# EAGLE design M8-SHT30 (EAGLE 9.6.2)
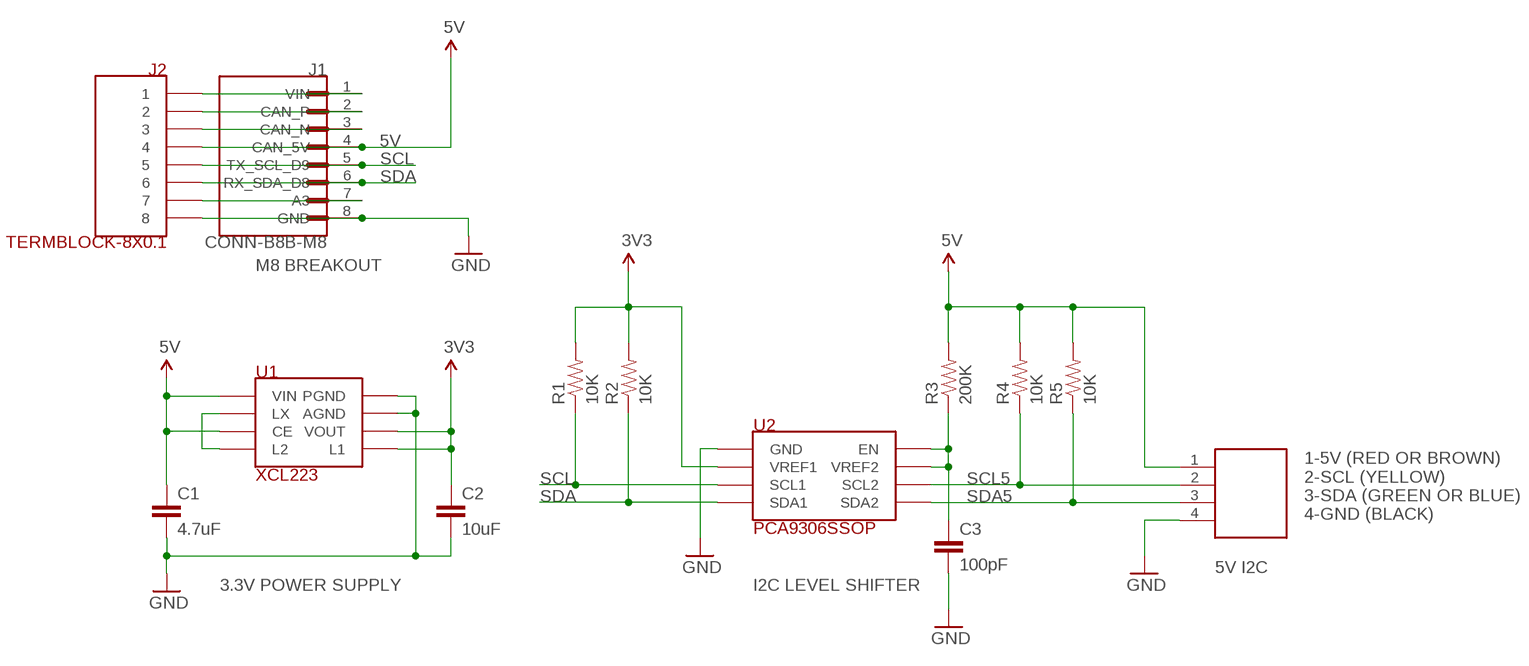
[diagram p0: schematic, sheet 1]

## Parts
C1  4.7uF  CAP-4.7UF-0603  [0603-CAP]
C2  10uF  CAP-10UF-0603  [0603-CAP]
C3  100pF  CAP-100PF-0603  [0603-CAP]
J1  CONN-B8B-M8  [JST_B8B-PH-SM4-TB(LF)(SN)]
J2  TERMBLOCK-8X0.1  [TERMBLOCK-8X0.1]
R1  10K  RES-10K-06030603  [0603-RES]
R2  10K  RES-10K-06030603  [0603-RES]
R3  200K  RES-200K-0603  [0603-RES]
R4  10K  RES-10K-06030603  [0603-RES]
R5  10K  RES-10K-06030603  [0603-RES]
U1  XCL223  REG-XCL223  [REG-XCL223-LESS-CREAM]
U2  PCA9306SSOP  [8-SSOP-TI]
U$1  TERMBLOCK-4X0.15  [TERMBLOCK-4X0.15]

## Nets
3V3: C2.1 R1.2 R2.2 U1.3(VOUT) U1.7(L1) U2.2(VREF1)
5V: C1.1 J1.4(CAN_5V) J2.P$4 R3.2 R4.2 R5.2 U1.4(CE) U1.6(VIN) U$1.1
A3: J1.7(A3) J2.P$7
CAN_N: J1.3(CAN_N) J2.P$3
CAN_P: J1.2(CAN_P) J2.P$2
GND: C1.2 C2.2 C3.2 J1.8(GND) J2.P$8 U1.1(PGND) U1.2(AGND) U2.1(GND) U$1.4
LX: U1.5(LX) U1.8(L2)
SCL: J1.5(TX_SCL_D9) J2.P$5 R1.1 U2.3(SCL1)
SCL5: R4.1 U2.6(SCL2) U$1.2
SDA: J1.6(RX_SDA_D8) J2.P$6 R2.1 U2.4(SDA1)
SDA5: R5.1 U2.5(SDA2) U$1.3
VIN: J1.1(VIN) J2.P$1
VREF2_EN: C3.1 R3.1 U2.7(VREF2) U2.8(EN)

## Notes on the sheet
- M8 BREAKOUT
- 1-5V (RED OR BROWN)
  2-SCL (YELLOW)
  3-SDA (GREEN OR BLUE)
  4-GND (BLACK)
- 5V I2C
- 3.3V POWER SUPPLY | I2C LEVEL SHIFTER

## Library data of the parts
C1 = rickk2:CAP-4.7UF-0603: Murata X5R series CAP CER 4.7UF 6.3V X5R 0603 $0.12 https://www.digikey.com/product-detail/en/murata-electronics-north-america/GRM188R60J475KE19J/490-6407-1-ND/3845604
C2 = rickk2:CAP-10UF-0603: CAP CER 10UF 16V X5R 0805 $ 0.21 https://www.digikey.com/product-detail/en/murata-electronics-north-america/GRM21BR61C106KE15L/490-3886-1-ND/965928
C3 = rickk2:CAP-100PF-0603: CAP 100PF 0603
J1 = rickk2:CONN-B8B-M8: PH Series 2 mm Pitch 12 Position SMT Single Row Top Entry Shrouded Header
J2 = rickk2:TERMBLOCK-8X0.1: Term Block 8x0.1" 20-30AWG 6A 125V Max Side Entry On Shore Technology Inc. OSTVN08A150 TERM BLK 8P SIDE ENT 2.54MM PCB 8 Position Wire to Board Terminal Block Horizontal with Board 0.100" (2.54mm) Through Hole https://www.digikey.com/product-detail/en/on-shore-technology-inc/OSTVN08A150/ED10566-ND/1588868
R1 R2 R4 R5 = rickk2:RES-10K-0603: RES SMD 10K OHM 5% 1/4W 0603 $ 0.10 https://www.digikey.com/product-detail/en/panasonic-electronic-components/ERJ-PA3J103V/P10KBZCT-ND/5036237
R3 = rickk2:RES-200K-0603: RES SMD 200K https://www.digikey.com/product-detail/en/panasonic-electronic-components/ERJ-3EKF2003V/P200KHCT-ND/198241
U1 = rickk2:REG-XCL223: Manufacturer: Torex Semiconductor Ltd Manufacturer Part Number: XCL223A333D2-G DC DC CONVERTER 3.3V Detailed Description: Non-Isolated PoL Modul $2.63 https://www.digikey.com/product-detail/en/torex-semiconductor-ltd/XCL223A333D2-G/893-1416-1-ND/8256118 CIN=4.7uF 10V CL = 10uF 10V VIN MAX=5.5V VOUT=3.3V
U2 = rickk2:PCA9306: IC TRNSLTR BIDIRECTIONAL SM8 PCA9306DCTR $0.67 https://www.digikey.com/product-detail/en/texas-instruments/PCA9306DCTR/296-18509-1-ND/809938 VREF1=3.3V VREF2=5V connect w/200K res and 100 pF cap to GND Use 8-SSOP version!
U$1 = rickk2:TERMBLOCK-4X0.15: Have this - used on GarageDoor2 for prox sensor

## Board
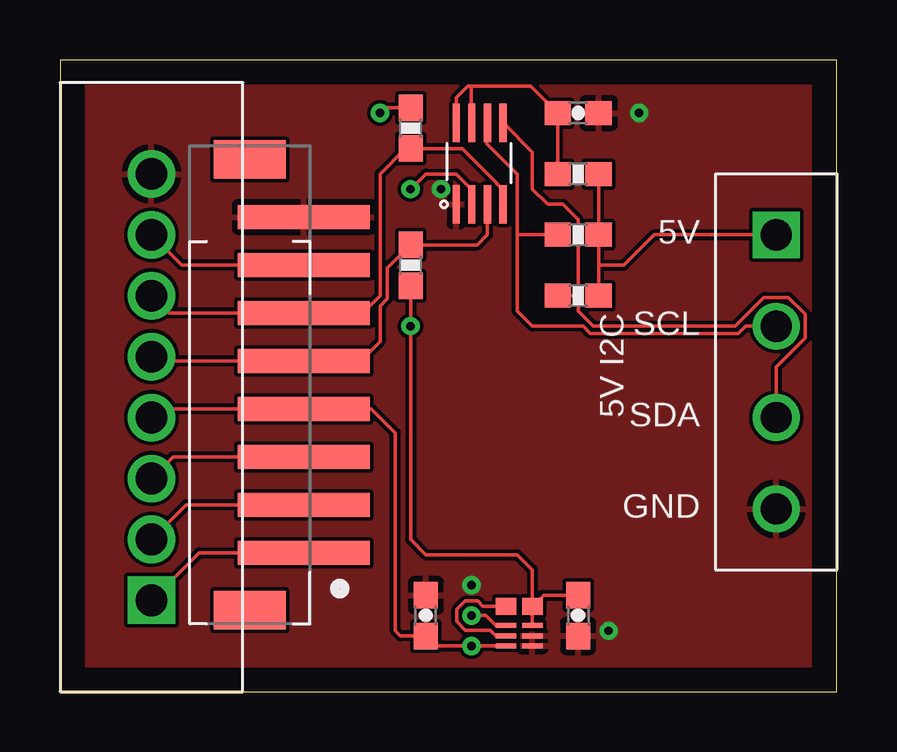
[diagram p1: board, top side]
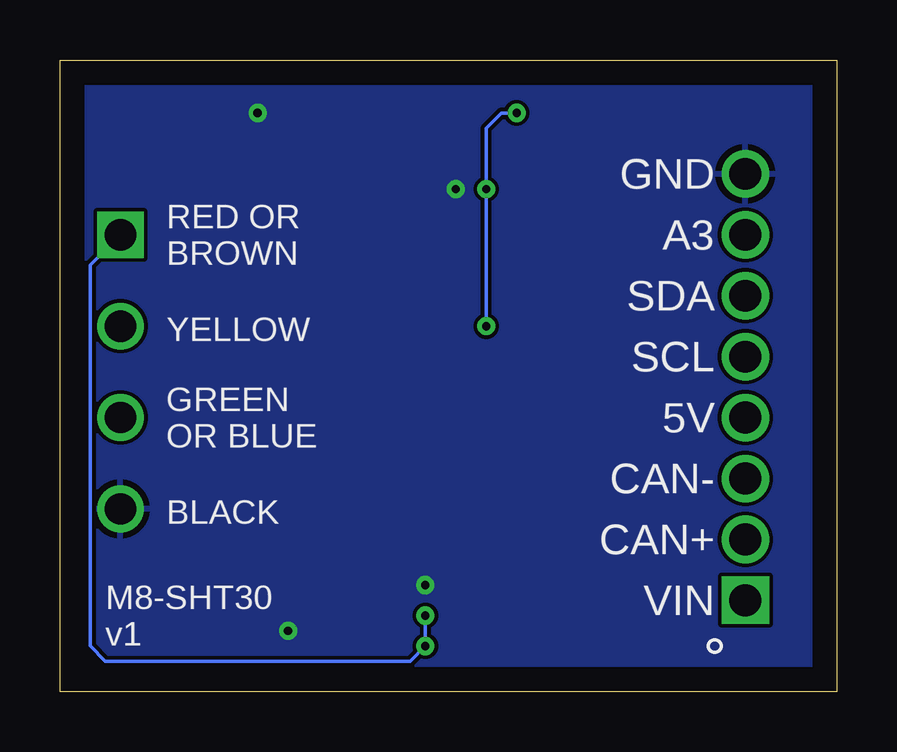
[diagram p2: board, bottom side, seen from below]

Size 32.37 x 26.34 mm. Coordinates in mm from the lower left corner, seen from the top.
Outline: 0,0 32.37,0 32.37,26.34 0,26.34 0,0
Copper layers (1*16): Top 0.035mm / dielectric 1.5mm / Bottom 0.035mm
Design rules "default": minimum track width 6mil, minimum drill 0.35mm, track to track 6mil, track to pad 6mil, pad to pad 6mil, via to via 6mil, smd to smd 6mil, copper to edge 40mil, drill to drill 6mil, minimum pad ring 10mil, minimum via ring 8mil, stop-mask expansion 4mil, vias tented up to drill 0mil, thermal gap 10mil

### Footprints (pad centres in the part's own frame; a part is rotated, then mirrored left to right if it is on the bottom)
0603-CAP = smd 1.1 x 1: 1 -0.85,0; 2 0.85,0
JST_B8B-PH-SM4-TB(LF)(SN) = smd 1 x 5.5: 1 -5,0; 2 -3,0; 3 -1,0; 4 1,0; 5 3,0; 6 5,0; 7 7,0; 8 9,0 | smd 1.6 x 3: P1 -7.4,2.25; P2 11.4,2.25
TERMBLOCK-8X0.1 = drill 1.321 square: P$1 -8.89,0 | drill 1.321: P$2 -6.35,0; P$3 -3.81,0; P$4 -1.27,0; P$5 1.27,0; P$6 3.81,0; P$7 6.35,0; P$8 8.89,0
0603-RES = smd 1.1 x 1: 1 -0.85,0; 2 0.85,0
REG-XCL223-LESS-CREAM = smd 0.85 x 0.21: 1 0,0; 2 0,0.43; 3 0,0.86; 4 -1.11,0.86; 5 -1.11,0.43; 6 -1.11,0 | smd 0.85 x 0.7: 7 0,1.655; 8 -1.11,1.655
8-SSOP-TI = smd 0.3 x 1.6: 1 0,0; 2 0.65,0; 3 1.3,0; 4 1.95,0; 5 1.95,3.4; 6 1.3,3.4; 7 0.65,3.4; 8 0,3.4
TERMBLOCK-4X0.15 = drill 1.3 square: 1 -3.81,0 | drill 1.3: 2 0,0; 3 3.81,0; 4 7.62,0

### Placement (x,y rotation side)
C1  15.24,3.17 90 top
C2  21.59,3.17 270 top
C3  21.59,24.13 0 top
J1  10.16,10.79 90 top
J2  3.81,12.7 90 top
R1  14.61,17.78 270 top
R2  14.61,23.5 90 top
R3  21.59,21.59 0 top
R4  21.59,19.05 0 top
R5  21.59,16.51 0 top
U1  19.68,1.91 0 top
U2  16.51,20.32 0 top
U$1  29.84,15.24 270 top

### Tracks (layer width: path | path; a pad name or v marks a point on that pad's centre or on a via)
3V3  (via drill 0.35)
  Top 0.152: U1.3 U1.7 | U2.2 17.16,20.94 16.51,21.59 15.24,21.59 v14.61,20.95 | R1.2 v14.61,15.24 14.61,6.35 15.24,5.71 19.05,5.71 19.68,5.08 U1.7 | v13.34,24.13 13.55,24.34 R2.2 | U1.7 20.15,4.03 C2.1
  Bottom 0.152: v14.61,15.24 v14.61,20.95 14.61,23.5 13.97,24.13 v13.34,24.13
5V  (via drill 0.35)
  Top 0.152: U1.4 18.15,2.77 17.74,3.17 v17.14,3.17 | U1.6 v17.14,1.91 15.66,1.91 C1.1 14.19,2.33 13.97,2.54 13.97,10.79 12.97,11.79 J1.4 4.17,11.79 J2.P$4 | R5.2 22.44,17.78 | 22.44,17.78 R4.2 R3.2 | 22.44,17.78 23.5,17.78 24.77,19.05 U$1.1
  Bottom 0.152: v17.14,3.17 v17.14,1.91 17.78,1.27 30.48,1.27 31.11,1.91 31.11,17.78 U$1.1
A3
  Top 0.152: J1.7 5.07,17.8 J2.P$7
CAN_N
  Top 0.152: J1.3 4.71,9.79 J2.P$3
CAN_P
  Top 0.152: J1.2 5.25,7.79 J2.P$2
GND  (via drill 0.35)
  other vias: 17.14,4.45 22.86,2.54 15.88,20.95 24.13,24.13
  pour Top: 0,0 0,31.75 40.64,31.75 40.64,0
  pour Bottom: 0,0 0,31.75 41.91,31.75 41.91,0
LX
  Top 0.152: U1.8 17.62,3.56 17.4,3.78 16.89,3.78 16.54,3.43 16.54,2.92 16.89,2.57 17.92,2.57 18.15,2.33 U1.5
SCL
  Top 0.152: U2.3 17.81,19.05 17.39,18.63 R1.1 13.64,17.66 13.64,16.38 13.34,16.08 13.34,14.61 12.53,13.79 J1.5 3.98,13.79 J2.P$5
SCL5
  Top 0.152: 19.05,19.05 19.05,21.59 17.78,22.86 17.78,23.69 U2.6 | R4.1 19.05,19.05 | U$1.2 28.57,15.24 28.27,14.94 22.1,14.94 21.79,15.24 19.68,15.24 19.05,15.88 19.05,19.05
SDA
  Top 0.152: U2.4 18.46,20.91 18.19,21.18 18.19,21.21 16.76,22.64 R2.1 14.39,22.64 13.34,21.59 13.34,16.51 12.62,15.79 J1.6 4.53,15.79 J2.P$6
SDA5
  Top 0.152: U2.5 19.68,22.5 19.68,20.95 20.32,20.32 20.95,20.32 21.59,19.68 21.59,16.51 | 21.59,16.51 21.59,15.88 22.23,15.24 28.14,15.24 29.31,16.41 29.35,16.44 30.34,16.44 31.05,15.74 31.05,14.74 29.84,13.54 U$1.3 | R5.1 21.59,16.51
VIN
  Top 0.152: J2.P$1 5.79,5.79 J1.1
VREF2_EN
  Top 0.152: R3.1 C3.1 19.62,25.25 17.14,25.25 | U2.8 16.51,24.77 16.99,25.25 17.14,25.25 | U2.7 17.14,23.73 17.14,25.25

### Text on the board
tPlace: 5V | SCL | SDA | 5V I2C | GND
bPlace: GND | A3 | RED OR / BROWN | SDA | SCL | YELLOW | 5V | CAN- | GREEN / OR BLUE | CAN+ | BLACK | VIN | M8-SHT30 / v1